# Altium schematic sheet Power.SchDoc
size A
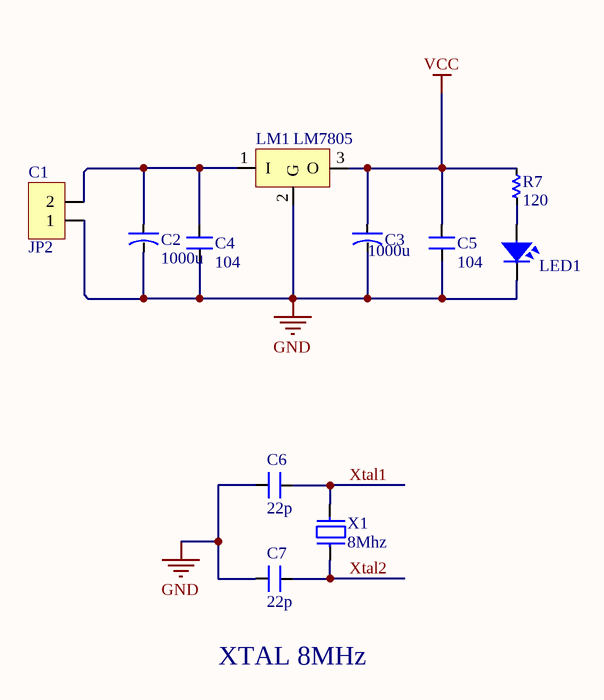
[diagram p0: Power.SchDoc]

## Parts
C1  JP2  [JP2-D1T]
C2  1000u  [CA-ALU-2.54]
C3  1000u  [CA-ALU-2.54]
C4  104  [C-SE-7,5x11x13x9x4]
C5  104  [C-SE-7,5x11x13x9x4]
C6  22p  [C-SE-7,5x11x13x9x4]
C7  22p  [C-SE-7,5x11x13x9x4]
LED1  LED  [LED-3MM-RED]  (value not drawn)
LM1  LM78xx  [TO92-321]  (value not drawn)
R7  120  [RES-1/2W]
X1  8Mhz  [XT2]

## Nets
GND: C1.1 C2.2 C3.2 C4.1 C5.1 C6.1 C7.1 LED1.2 LM1.2(G)
VCC: C3.1 C5.2 LM1.3(O) R7.1
Xtal1: C6.2 X1.2
Xtal2: C7.2 X1.1
NetC1_2: C1.2 C2.1 C4.2 LM1.1(I)
NetLED1_1: LED1.1 R7.2

## Notes on the sheet
- (near LM1) LM7805
- XTAL 8MHz

## Library data of the parts
C1 = JP2: WR-PHD 2.54 mm Angled Socket Header; pin to pad: 1>2 2>1; Manufacturer: W¨¹rth Elektronik eiSos GmbH; partNo: 613002143121; ComponentLink1 Description: Manufacturer; ComponentLink2 Description: Datasheet; NoPins: 02; Rule: PcbType=ProtelPcb; Created Date: 29 March 2013; ComponentLink1URL: http://www.we-online.com; ComponentLink2URL: http://katalog.we-online.de/em/datasheet/6130xx143121.pdf; Created by: Karrer Zheng
C2 C3 = CN-ALU-DIP: Capacitor (Semiconductor SIM Model); Value: 104; LatestRevisionDate: 17-Jul-2002; LatestRevisionNote: Re-released for DXP Platform.; PackageReference: C1206; Publisher: Altium Limited
C4 C5 = CN-SEMI-DIP: Capacitor (Semiconductor SIM Model); LatestRevisionDate: 17-Jul-2002; LatestRevisionNote: Re-released for DXP Platform.; PackageReference: C1206; Publisher: Altium Limited; Value: 104
C6 C7 = CN-SEMI-DIP: Capacitor (Semiconductor SIM Model); Value: 104; LatestRevisionDate: 17-Jul-2002; LatestRevisionNote: Re-released for DXP Platform.; PackageReference: C1206; Publisher: Altium Limited
LED1 = LED: LED Single colour Green and Red; Value: LED 3 ly Single Colour
LM1 = LM78xx: Positive Voltage Regulator; Note: Tab is connected to pin 3 (GND).; Published: 24-Aug-2001; LatestRevisionDate: 17-Jul-2002; LatestRevisionNote: Re-released for DXP Platform.; DatasheetVersion: Apr-1994; PackageVersion: Jul-1998; PackageReference: ISOWATT220AB; Publisher: Altium Limited; PackageDescription: TO, Thru-Hole, Vertical, Heatsink Mounted; 3 In-Line Leads; Pitch 2.54 mm; Pin sequence 1, 3, 2; ComponentLink1Description: Manufacturer Link; ComponentLink1URL: http://www.st.com/; ComponentLink2Description: Datasheet; ComponentLink2URL: http://www.st.com/stonline/products/literature/ds/2146/l78m05c.pdf
R7 = Res: Manufacturer: Generic Components; Class: Passive; SubClass: R; Published: 08/06/2000; Publisher: Altium Hobart Technology Centre
X1 = XT2: Crystal, 32.768 KHz, -40 to 85 degC, 3.2 x 1.5 x 0.9 mm SMD; Value: 4Mhz